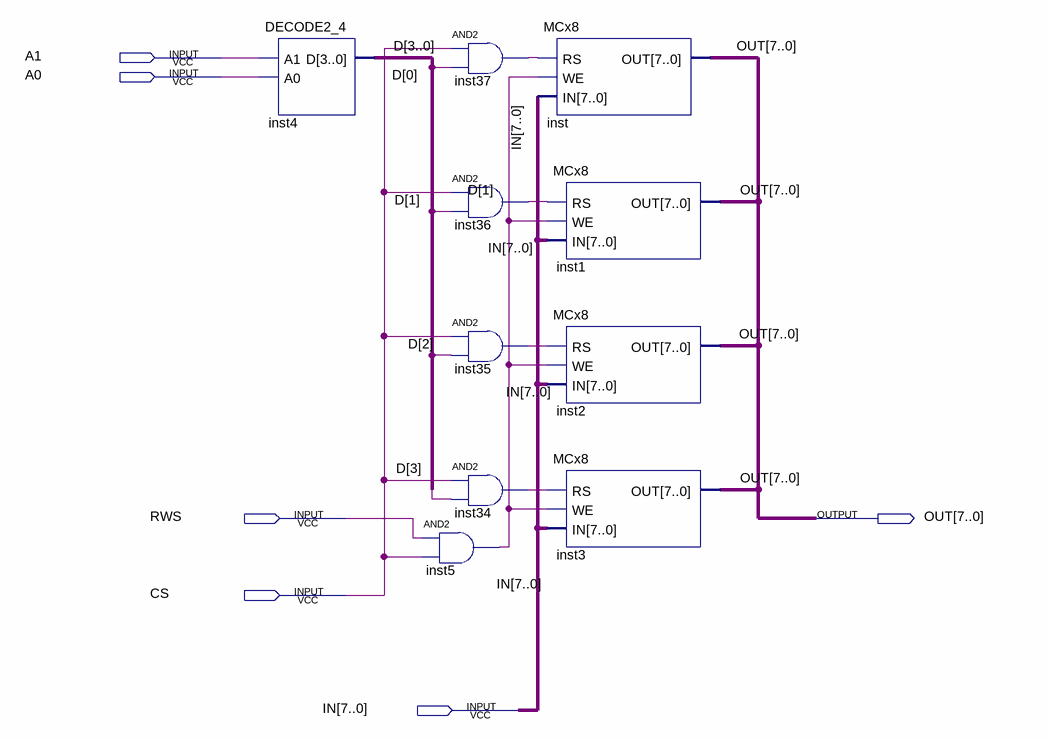
[diagram p0: schematic sheet]
// Quartus schematic RAM4x8bit.bdf as structural Verilog: 10 symbols, 6 pins
module RAM4x8bit (
  input  A1,
  input  A0,
  input  RWS,
  input  CS,
  input  [7:0] IN,
  output [7:0] OUT
);

  wire inst5_out, inst34_out, inst35_out, inst37_out;
  wire [3:0] D;

  DECODE2_4 inst4 (.A1(A1), .A0(A0), .D(D));
  and inst37 (inst37_out, CS, D[0]);
  and inst36 (D[1], CS, D[1]);
  and inst35 (inst35_out, CS, D[2]);
  and inst34 (inst34_out, CS, D[3]);
  and inst5 (inst5_out, RWS, CS);
  MCx8 inst (.RS(inst37_out), .WE(inst5_out), .IN(IN), .OUT(OUT));
  MCx8 inst1 (.RS(D[1]), .WE(inst5_out), .IN(IN), .OUT(OUT));
  MCx8 inst2 (.RS(inst35_out), .WE(inst5_out), .IN(IN), .OUT(OUT));
  MCx8 inst3 (.RS(inst34_out), .WE(inst5_out), .IN(IN), .OUT(OUT));
endmodule
